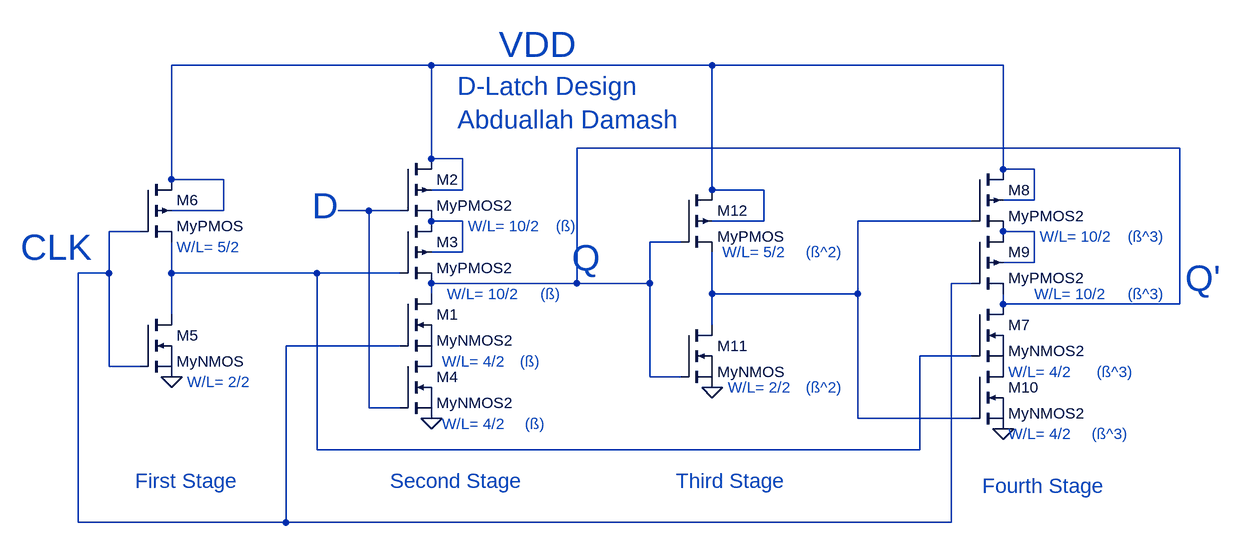
[diagram p0: schematic D Latch Design For Report.asc]
D Latch Design For Report.asc, the LTspice schematic file:
Version 4
SHEET 1 1356 1316
WIRE -112 -48 -512 -48
WIRE 320 -48 -112 -48
WIRE 768 -48 320 -48
WIRE 1040 80 112 80
WIRE -112 96 -112 -48
WIRE -64 96 -112 96
WIRE 768 112 768 -48
WIRE 816 112 768 112
WIRE -512 128 -512 -48
WIRE -432 128 -512 128
WIRE -64 144 -64 96
WIRE -64 144 -112 144
WIRE 320 144 320 -48
WIRE 400 144 320 144
WIRE 816 160 816 112
WIRE 816 160 768 160
WIRE -432 176 -432 128
WIRE -432 176 -512 176
WIRE -208 176 -256 176
WIRE -160 176 -208 176
WIRE -64 192 -112 192
WIRE 400 192 400 144
WIRE 400 192 320 192
WIRE 720 192 544 192
WIRE -560 208 -608 208
WIRE 816 208 768 208
WIRE 272 224 224 224
WIRE -64 240 -64 192
WIRE -64 240 -112 240
WIRE 816 256 816 208
WIRE 816 256 768 256
WIRE -608 272 -608 208
WIRE -608 272 -656 272
WIRE -512 272 -512 224
WIRE -288 272 -512 272
WIRE -160 272 -288 272
WIRE 112 288 112 80
WIRE 112 288 -112 288
WIRE 224 288 224 224
WIRE 224 288 112 288
WIRE 720 288 688 288
WIRE -112 304 -112 288
WIRE 320 304 320 240
WIRE 544 304 544 192
WIRE 544 304 320 304
WIRE 768 320 768 304
WIRE 1040 320 1040 80
WIRE 1040 320 768 320
WIRE -512 336 -512 272
WIRE 320 352 320 304
WIRE -160 384 -336 384
WIRE 720 400 640 400
WIRE -608 416 -608 272
WIRE -560 416 -608 416
WIRE 224 432 224 288
WIRE 272 432 224 432
WIRE -208 480 -208 176
WIRE -160 480 -208 480
WIRE 544 496 544 304
WIRE 720 496 544 496
WIRE -288 544 -288 272
WIRE 640 544 640 400
WIRE 640 544 -288 544
WIRE -656 656 -656 272
WIRE -336 656 -336 384
WIRE -336 656 -656 656
WIRE 688 656 688 288
WIRE 688 656 -336 656
FLAG -112 496 0
FLAG -512 432 0
FLAG 768 512 0
FLAG 320 448 0
SYMBOL nmos -160 304 R0
SYMATTR InstName M1
SYMATTR Value MyNMOS2
SYMBOL pmos4 -160 96 R0
SYMATTR InstName M2
SYMATTR Value MyPMOS2
SYMBOL pmos4 -160 192 R0
SYMATTR InstName M3
SYMATTR Value MyPMOS2
SYMBOL nmos -160 400 R0
SYMATTR InstName M4
SYMATTR Value MyNMOS2
SYMBOL nmos -560 336 R0
SYMATTR InstName M5
SYMATTR Value MyNMOS
SYMBOL pmos4 -560 128 R0
SYMATTR InstName M6
SYMATTR Value MyPMOS
SYMBOL nmos 720 320 R0
SYMATTR InstName M7
SYMATTR Value MyNMOS2
SYMBOL pmos4 720 112 R0
SYMATTR InstName M8
SYMATTR Value MyPMOS2
SYMBOL pmos4 720 208 R0
SYMATTR InstName M9
SYMATTR Value MyPMOS2
SYMBOL nmos 720 416 R0
SYMATTR InstName M10
SYMATTR Value MyNMOS2
SYMBOL nmos 272 352 R0
SYMATTR InstName M11
SYMATTR Value MyNMOS
SYMBOL pmos4 272 144 R0
SYMATTR InstName M12
SYMATTR Value MyPMOS
TEXT -8 -80 Left 5 ;VDD
TEXT -744 232 Left 5 ;CLK
TEXT -296 168 Left 5 ;D
TEXT 104 248 Left 5 ;Q
TEXT 1048 280 Left 5 ;Q'
TEXT -72 -16 Left 4 ;D-Latch Design\nAbduallah Damash
TEXT -504 232 Left 2 ;W/L= 5/2
TEXT 336 240 Left 2 ;W/L= 5/2
TEXT -56 200 Left 2 ;W/L= 10/2
TEXT -88 304 Left 2 ;W/L= 10/2
TEXT 824 216 Left 2 ;W/L= 10/2
TEXT 816 304 Left 2 ;W/L= 10/2
TEXT -488 440 Left 2 ;W/L= 2/2
TEXT 344 448 Left 2 ;W/L= 2/2
TEXT -96 408 Left 2 ;W/L= 4/2
TEXT -96 504 Left 2 ;W/L= 4/2
TEXT 776 424 Left 2 ;W/L= 4/2
TEXT 776 520 Left 2 ;W/L= 4/2
TEXT -568 592 Left 3 ;First Stage
TEXT -176 592 Left 3 ;Second Stage
TEXT 264 592 Left 3 ;Third Stage
TEXT 736 600 Left 3 ;Fourth Stage
TEXT 32 504 Left 2 ;(ß)
TEXT 24 408 Left 2 ;(ß)
TEXT 56 304 Left 2 ;(ß)
TEXT 80 200 Left 2 ;(ß)
TEXT 464 448 Left 2 ;(ß^2)
TEXT 464 240 Left 2 ;(ß^2)
TEXT 904 520 Left 2 ;(ß^3)
TEXT 912 424 Left 2 ;(ß^3)
TEXT 960 216 Left 2 ;(ß^3)
TEXT 960 304 Left 2 ;(ß^3)

The netlist it stands for:
* D Latch Design For Report.asc
M1 N002 N006 P001 P001 MyNMOS2
M2 N001 N003 N004 N001 MyPMOS2
M3 N004 N008 N002 N004 MyPMOS2
M4 P001 N003 0 0 MyNMOS2
M5 N008 N006 0 0 MyNMOS
M6 N001 N006 N008 N001 MyPMOS
M7 N002 N008 P002 P002 MyNMOS2
M8 N001 N005 N007 N001 MyPMOS2
M9 N007 N006 N002 N007 MyPMOS2
M10 P002 N005 0 0 MyNMOS2
M11 N005 N002 0 0 MyNMOS
M12 N001 N002 N005 N001 MyPMOS
.model NMOS NMOS
.model PMOS PMOS
.lib standard.mos
* VDD
* CLK
* D
* Q
* Q'
* D-Latch Design
* Abduallah Damash
* W/L= 5/2
* W/L= 5/2
* W/L= 10/2
* W/L= 10/2
* W/L= 10/2
* W/L= 10/2
* W/L= 2/2
* W/L= 2/2
* W/L= 4/2
* W/L= 4/2
* W/L= 4/2
* W/L= 4/2
* First Stage
* Second Stage
* Third Stage
* Fourth Stage
* (ß)
* (ß)
* (ß)
* (ß)
* (ß^2)
* (ß^2)
* (ß^3)
* (ß^3)
* (ß^3)
* (ß^3)
.backanno
.end